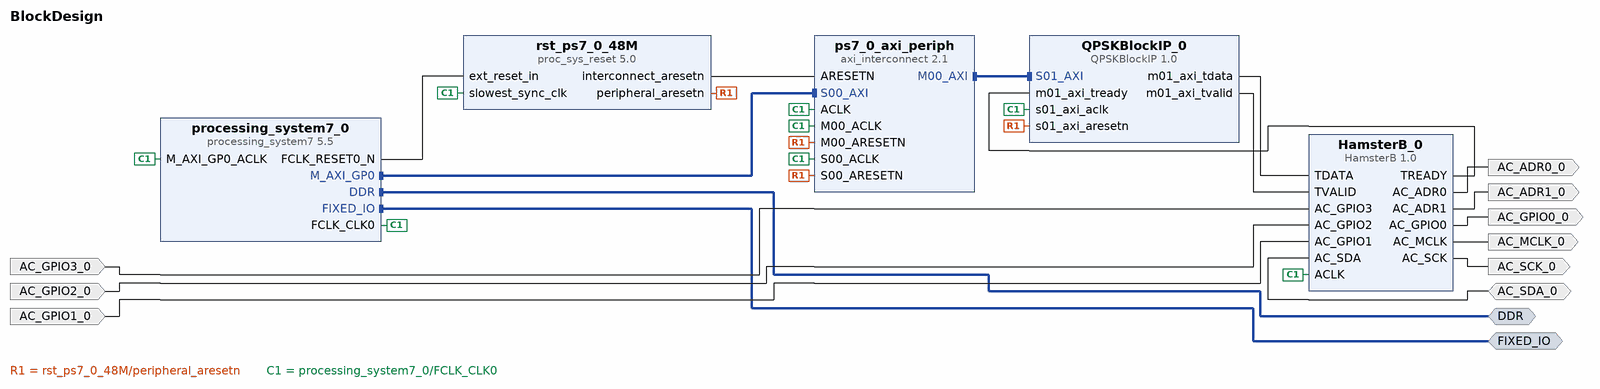
[diagram p0: block diagram of the top level]
# Vivado block design BlockDesign, xc7z020clg484-1, Vivado 2018.3
create_bd_design BlockDesign

create_bd_intf_port -mode Master -vlnv xilinx.com:interface:ddrx_rtl:1.0 DDR
create_bd_intf_port -mode Master -vlnv xilinx.com:display_processing_system7:fixedio_rtl:1.0 FIXED_IO
create_bd_port -dir O AC_MCLK_0
create_bd_port -dir O AC_GPIO0_0
create_bd_port -dir I AC_GPIO3_0
create_bd_port -dir O AC_ADR1_0
create_bd_port -dir O AC_SCK_0
create_bd_port -dir I AC_GPIO2_0
create_bd_port -dir O AC_ADR0_0
create_bd_port -dir I AC_GPIO1_0
create_bd_port -dir IO AC_SDA_0

create_bd_cell -type ip -vlnv xilinx.com:ip:processing_system7:5.5 processing_system7_0
set_property -dict [list \
  CONFIG.PCW_APU_PERIPHERAL_FREQMHZ 666.666667 \
  CONFIG.PCW_ENET0_PERIPHERAL_ENABLE 0 \
  CONFIG.PCW_FCLK_CLK0_BUF FALSE \
  CONFIG.PCW_FPGA0_PERIPHERAL_FREQMHZ 48 \
  CONFIG.PCW_FPGA1_PERIPHERAL_FREQMHZ 150.000000 \
  CONFIG.PCW_GPIO_MIO_GPIO_ENABLE 0 \
  CONFIG.PCW_PRESET_BANK1_VOLTAGE {LVCMOS 1.8V} \
  CONFIG.PCW_QSPI_PERIPHERAL_ENABLE 0 \
  CONFIG.PCW_SD0_PERIPHERAL_ENABLE 0 \
  CONFIG.PCW_UART1_PERIPHERAL_ENABLE 1 \
  CONFIG.PCW_UART1_UART1_IO {MIO 48 .. 49} \
  CONFIG.PCW_UART_PERIPHERAL_FREQMHZ 50 \
  CONFIG.PCW_UIPARAM_DDR_FREQ_MHZ 533.333313 \
  CONFIG.PCW_UIPARAM_DDR_PARTNO {MT41J128M16 HA-15E} \
  CONFIG.PCW_USB0_PERIPHERAL_ENABLE 0 \
  CONFIG.preset ZedBoard \
] [get_bd_cells processing_system7_0]
# 71 more settings of processing_system7_0 are not shown: defaults, MIO pin electricals, DDR timing, and values the tool derives
create_bd_cell -type ip -vlnv xilinx.com:ip:axi_interconnect:2.1 ps7_0_axi_periph
set_property -dict {CONFIG.NUM_MI 1} [get_bd_cells ps7_0_axi_periph]
create_bd_cell -type ip -vlnv xilinx.com:ip:proc_sys_reset:5.0 rst_ps7_0_48M
create_bd_cell -type ip -vlnv Unai:user:HamsterB:1.0 HamsterB_0
create_bd_cell -type ip -vlnv Unai:user:QPSKBlockIP:1.0 QPSKBlockIP_0

# ---- connections ----

connect_bd_intf_net [get_bd_intf_ports DDR] [get_bd_intf_pins processing_system7_0/DDR]
connect_bd_intf_net [get_bd_intf_ports FIXED_IO] [get_bd_intf_pins processing_system7_0/FIXED_IO]
connect_bd_intf_net [get_bd_intf_pins ps7_0_axi_periph/M00_AXI] [get_bd_intf_pins QPSKBlockIP_0/S01_AXI]
connect_bd_intf_net [get_bd_intf_pins processing_system7_0/M_AXI_GP0] [get_bd_intf_pins ps7_0_axi_periph/S00_AXI]
connect_bd_net [get_bd_pins QPSKBlockIP_0/m01_axi_tdata] [get_bd_pins HamsterB_0/TDATA]
connect_bd_net [get_bd_pins QPSKBlockIP_0/m01_axi_tvalid] [get_bd_pins HamsterB_0/TVALID]
connect_bd_net [get_bd_pins HamsterB_0/TREADY] [get_bd_pins QPSKBlockIP_0/m01_axi_tready]
connect_bd_net [get_bd_pins HamsterB_0/AC_MCLK] [get_bd_ports AC_MCLK_0]
connect_bd_net [get_bd_pins HamsterB_0/AC_GPIO0] [get_bd_ports AC_GPIO0_0]
connect_bd_net -net AC_GPIO3_0_1 [get_bd_ports AC_GPIO3_0] [get_bd_pins HamsterB_0/AC_GPIO3]
connect_bd_net [get_bd_pins HamsterB_0/AC_ADR1] [get_bd_ports AC_ADR1_0]
connect_bd_net [get_bd_pins HamsterB_0/AC_SCK] [get_bd_ports AC_SCK_0]
connect_bd_net -net AC_GPIO2_0_1 [get_bd_ports AC_GPIO2_0] [get_bd_pins HamsterB_0/AC_GPIO2]
connect_bd_net [get_bd_pins HamsterB_0/AC_ADR0] [get_bd_ports AC_ADR0_0]
connect_bd_net -net AC_GPIO1_0_1 [get_bd_ports AC_GPIO1_0] [get_bd_pins HamsterB_0/AC_GPIO1]
connect_bd_net [get_bd_ports AC_SDA_0] [get_bd_pins HamsterB_0/AC_SDA]
connect_bd_net [get_bd_pins processing_system7_0/FCLK_RESET0_N] [get_bd_pins rst_ps7_0_48M/ext_reset_in]
connect_bd_net [get_bd_pins rst_ps7_0_48M/peripheral_aresetn] \
  [get_bd_pins ps7_0_axi_periph/S00_ARESETN] [get_bd_pins ps7_0_axi_periph/M00_ARESETN] \
  [get_bd_pins QPSKBlockIP_0/s01_axi_aresetn]
connect_bd_net [get_bd_pins rst_ps7_0_48M/interconnect_aresetn] [get_bd_pins ps7_0_axi_periph/ARESETN]
connect_bd_net -net clk_wiz_0_clk_out1 [get_bd_pins processing_system7_0/FCLK_CLK0] \
  [get_bd_pins rst_ps7_0_48M/slowest_sync_clk] [get_bd_pins processing_system7_0/M_AXI_GP0_ACLK] \
  [get_bd_pins ps7_0_axi_periph/ACLK] [get_bd_pins ps7_0_axi_periph/S00_ACLK] [get_bd_pins ps7_0_axi_periph/M00_ACLK] \
  [get_bd_pins HamsterB_0/ACLK] [get_bd_pins QPSKBlockIP_0/s01_axi_aclk]

# ---- address map ----
assign_bd_address -offset 0x43C00000 -range 64K -target_address_space [get_bd_addr_spaces processing_system7_0/Data] [get_bd_addr_segs QPSKBlockIP_0/S01_AXI/S01_AXI_reg]

validate_bd_design
save_bd_design
